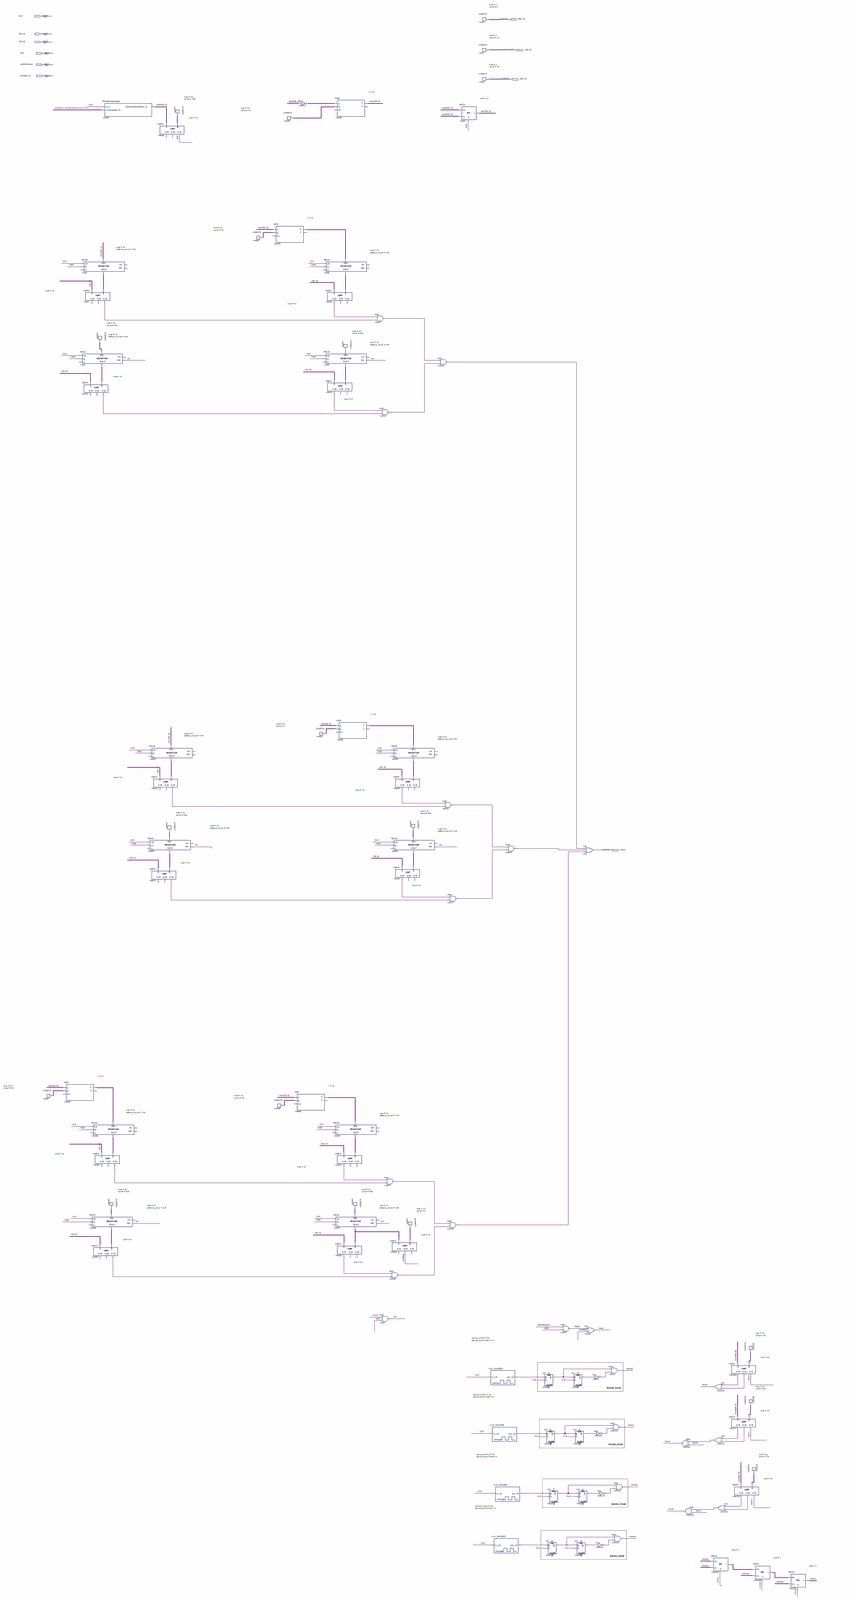
[diagram p0: schematic sheet, whole]
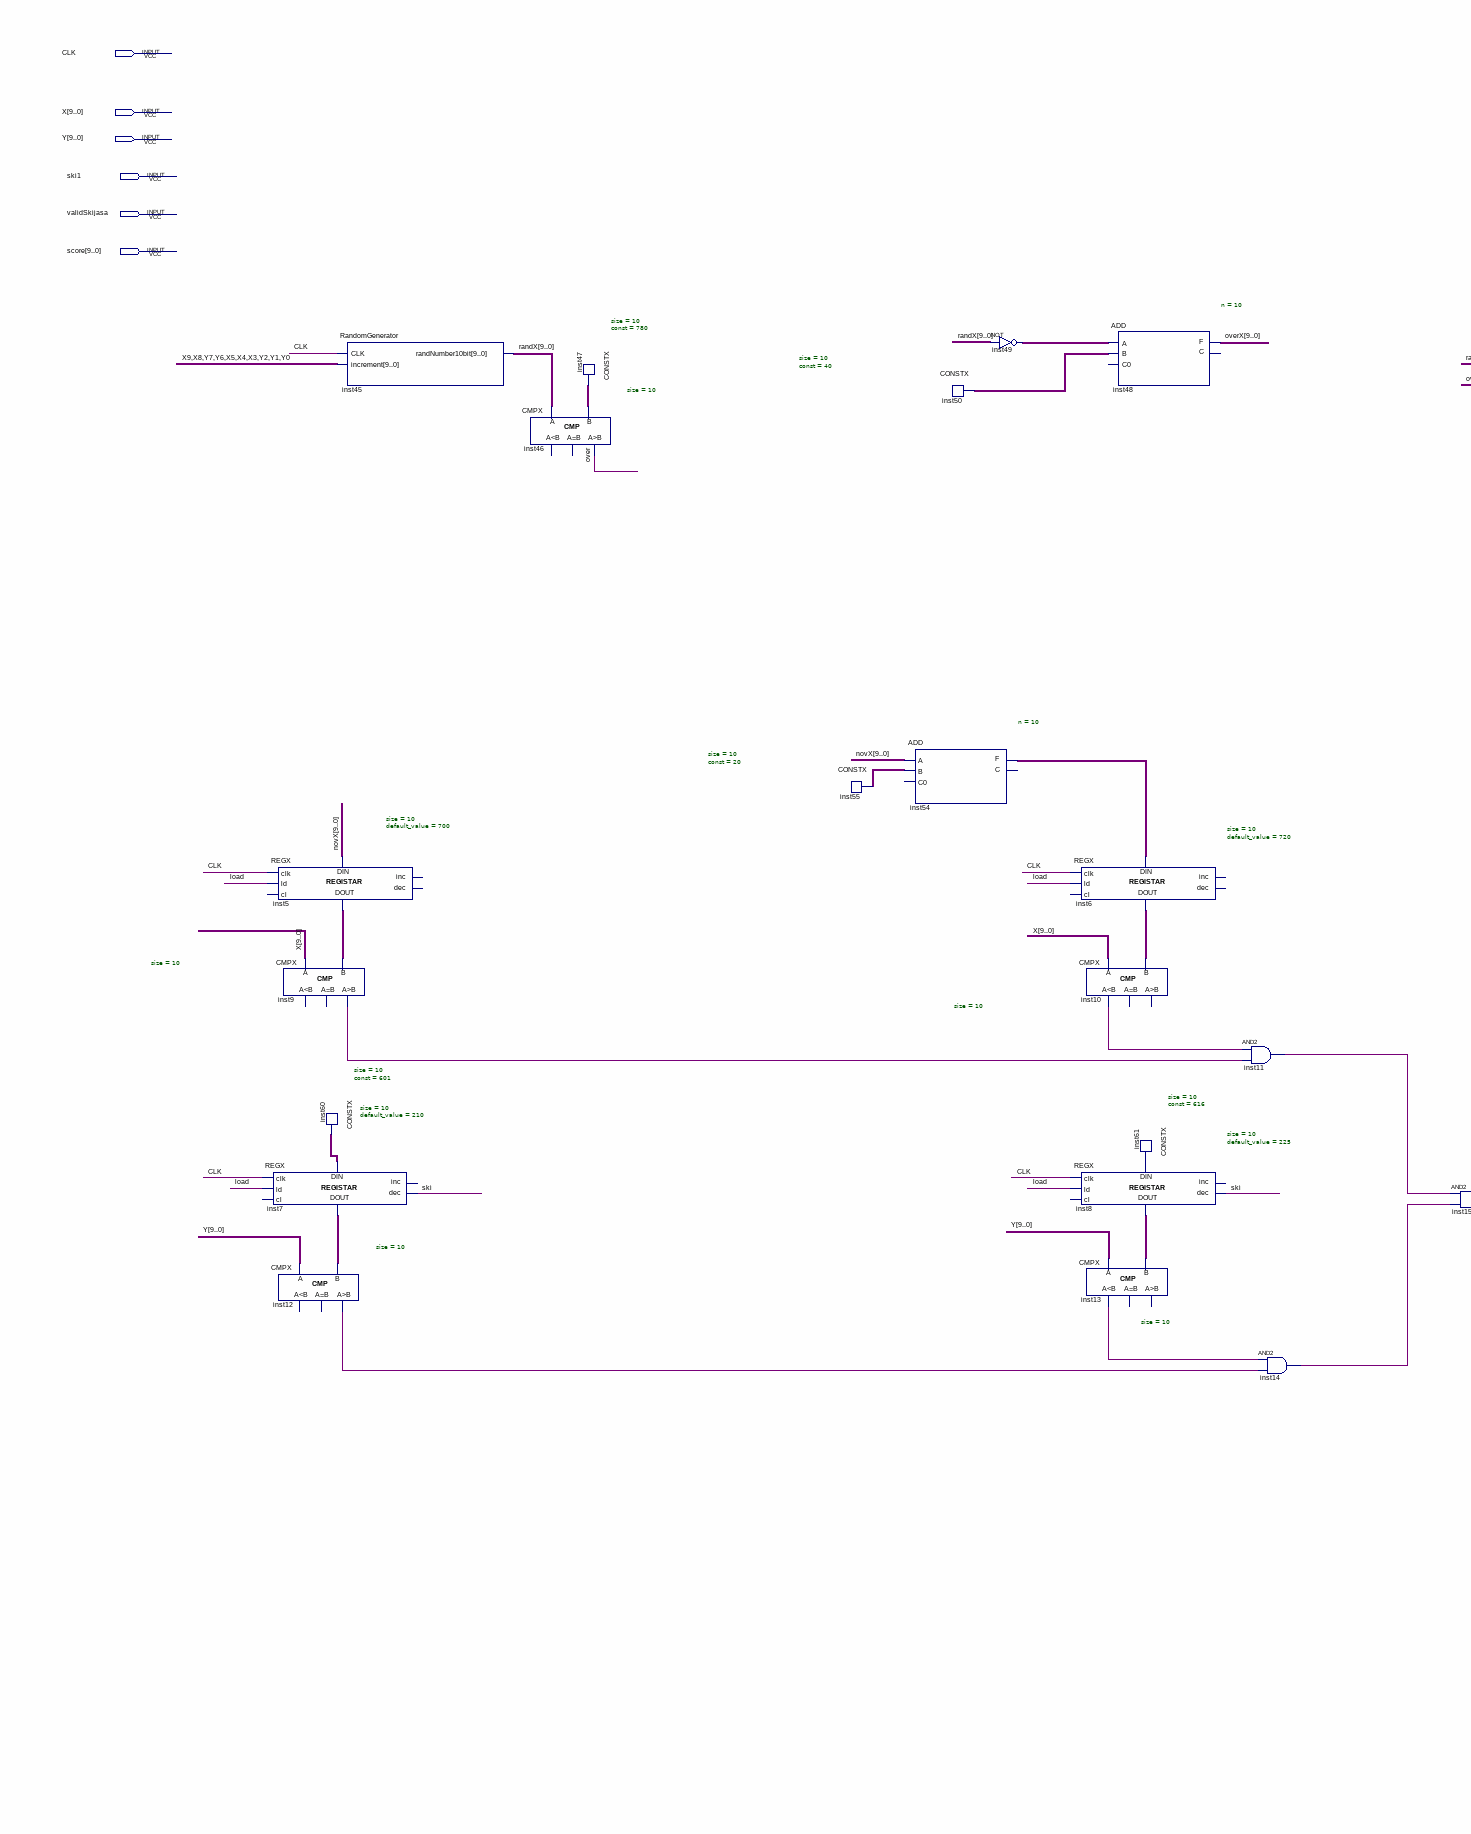
[diagram p1: schematic sheet, upper left part]
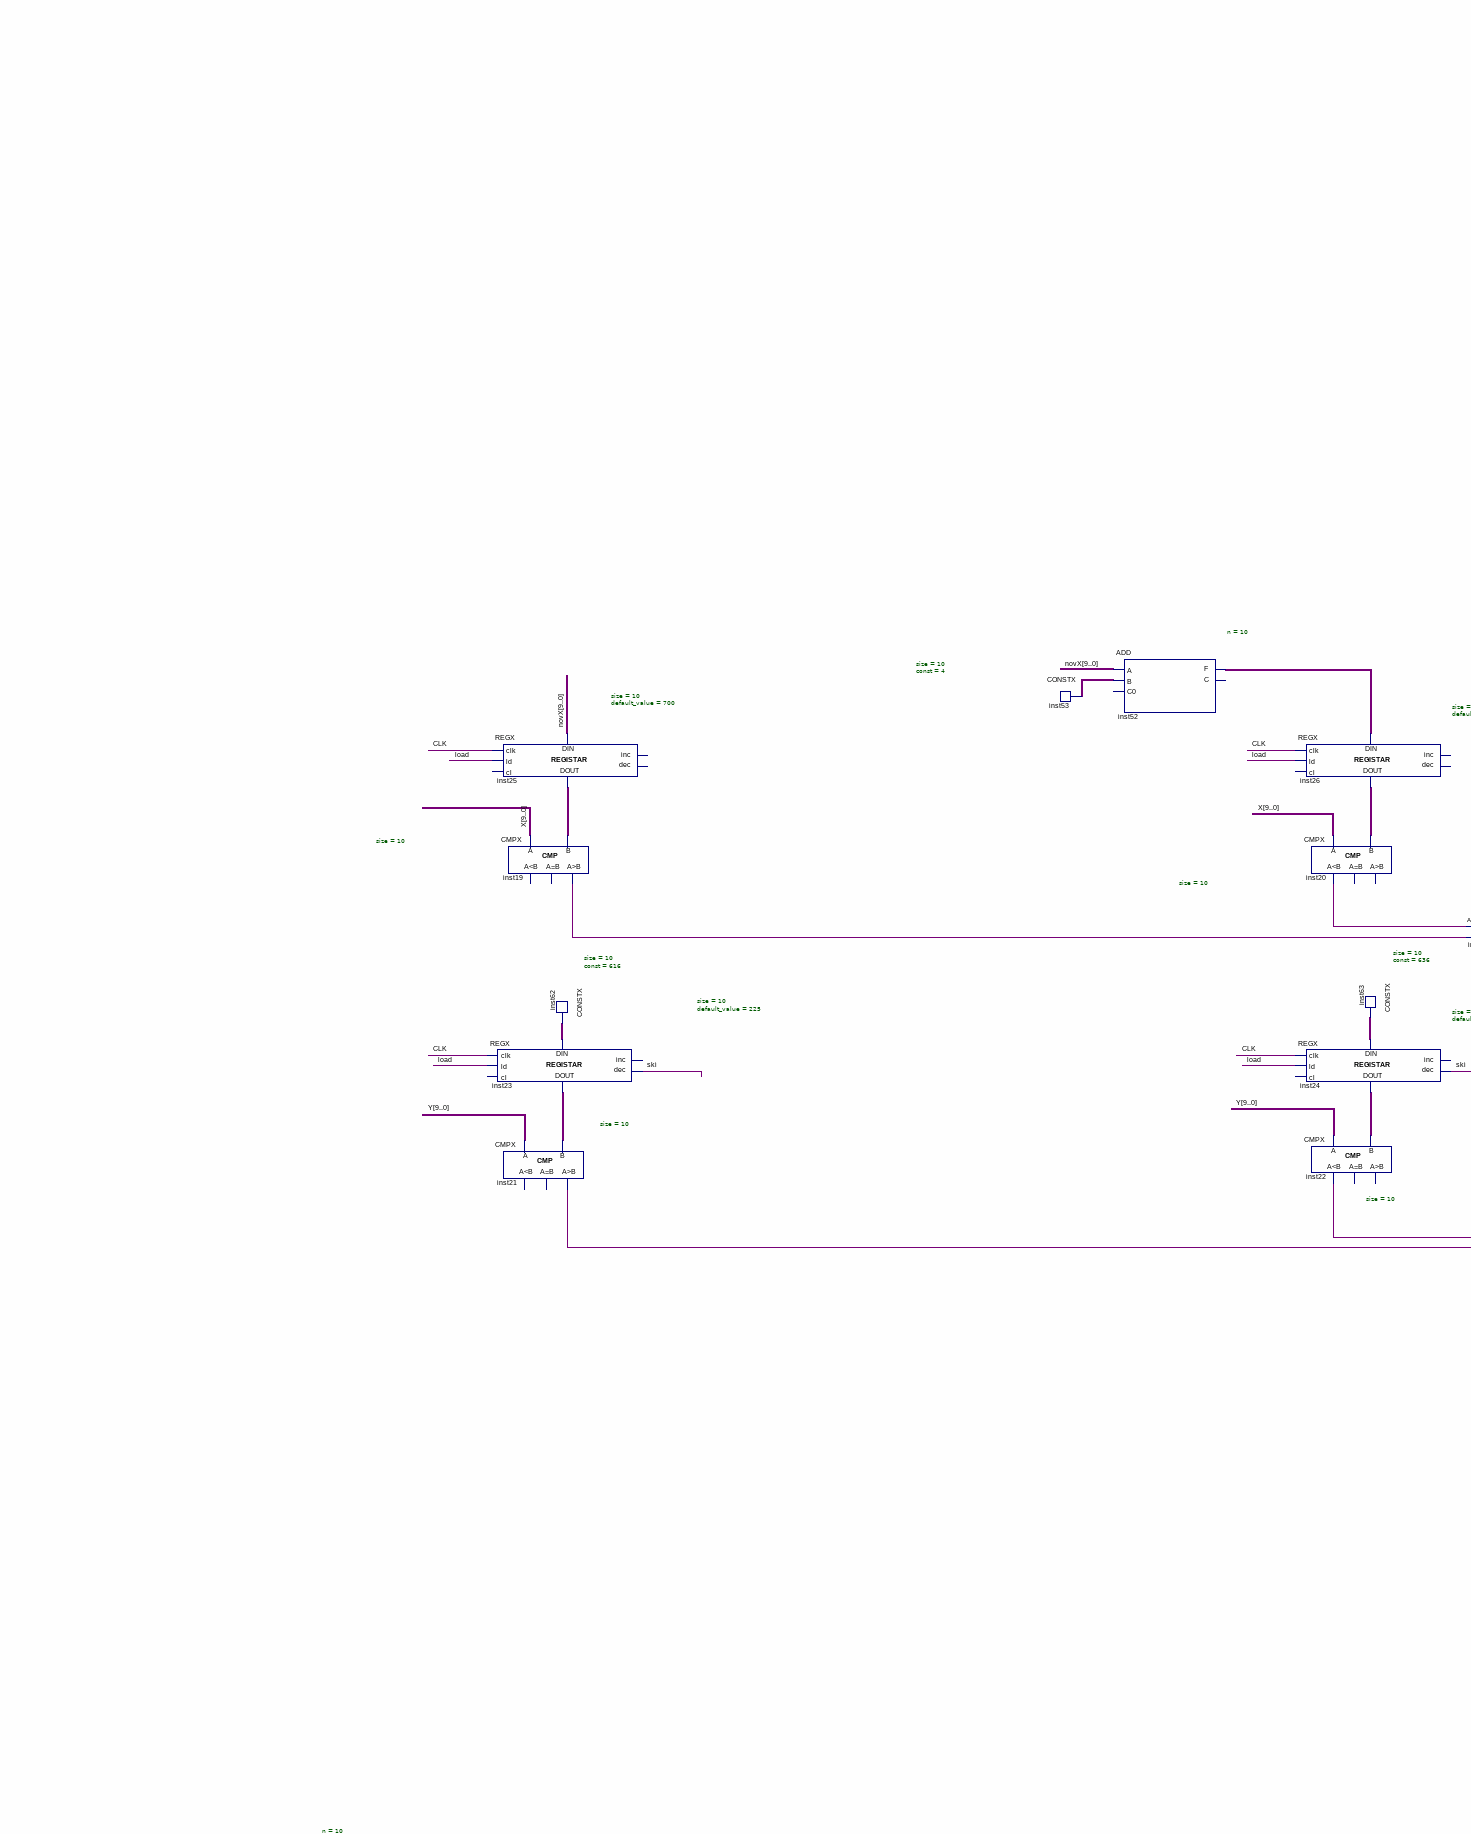
[diagram p2: schematic sheet, middle left part]
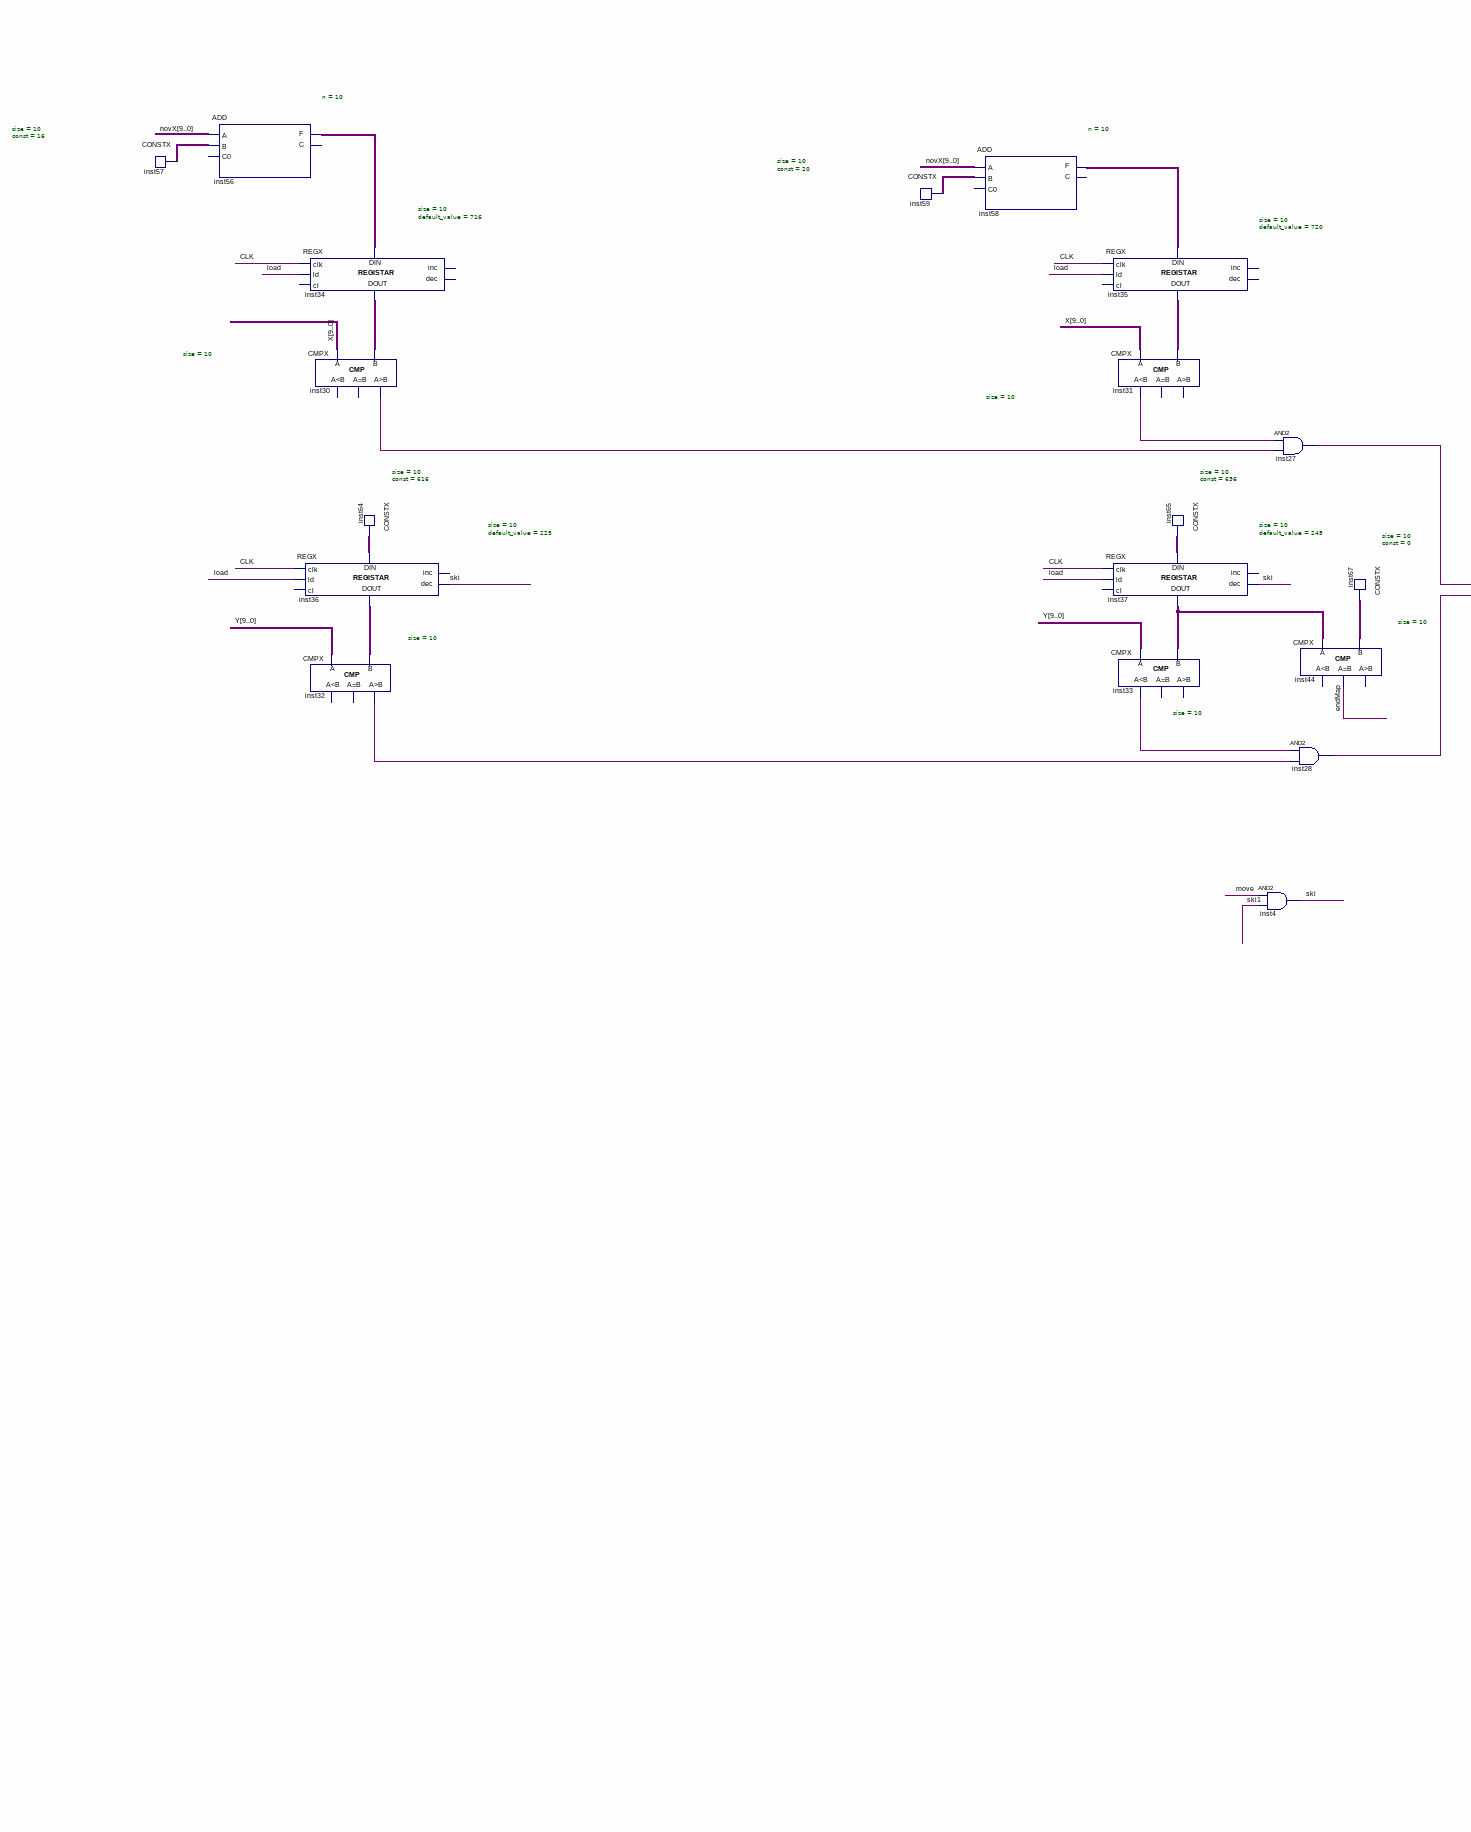
[diagram p3: schematic sheet, lower left part]
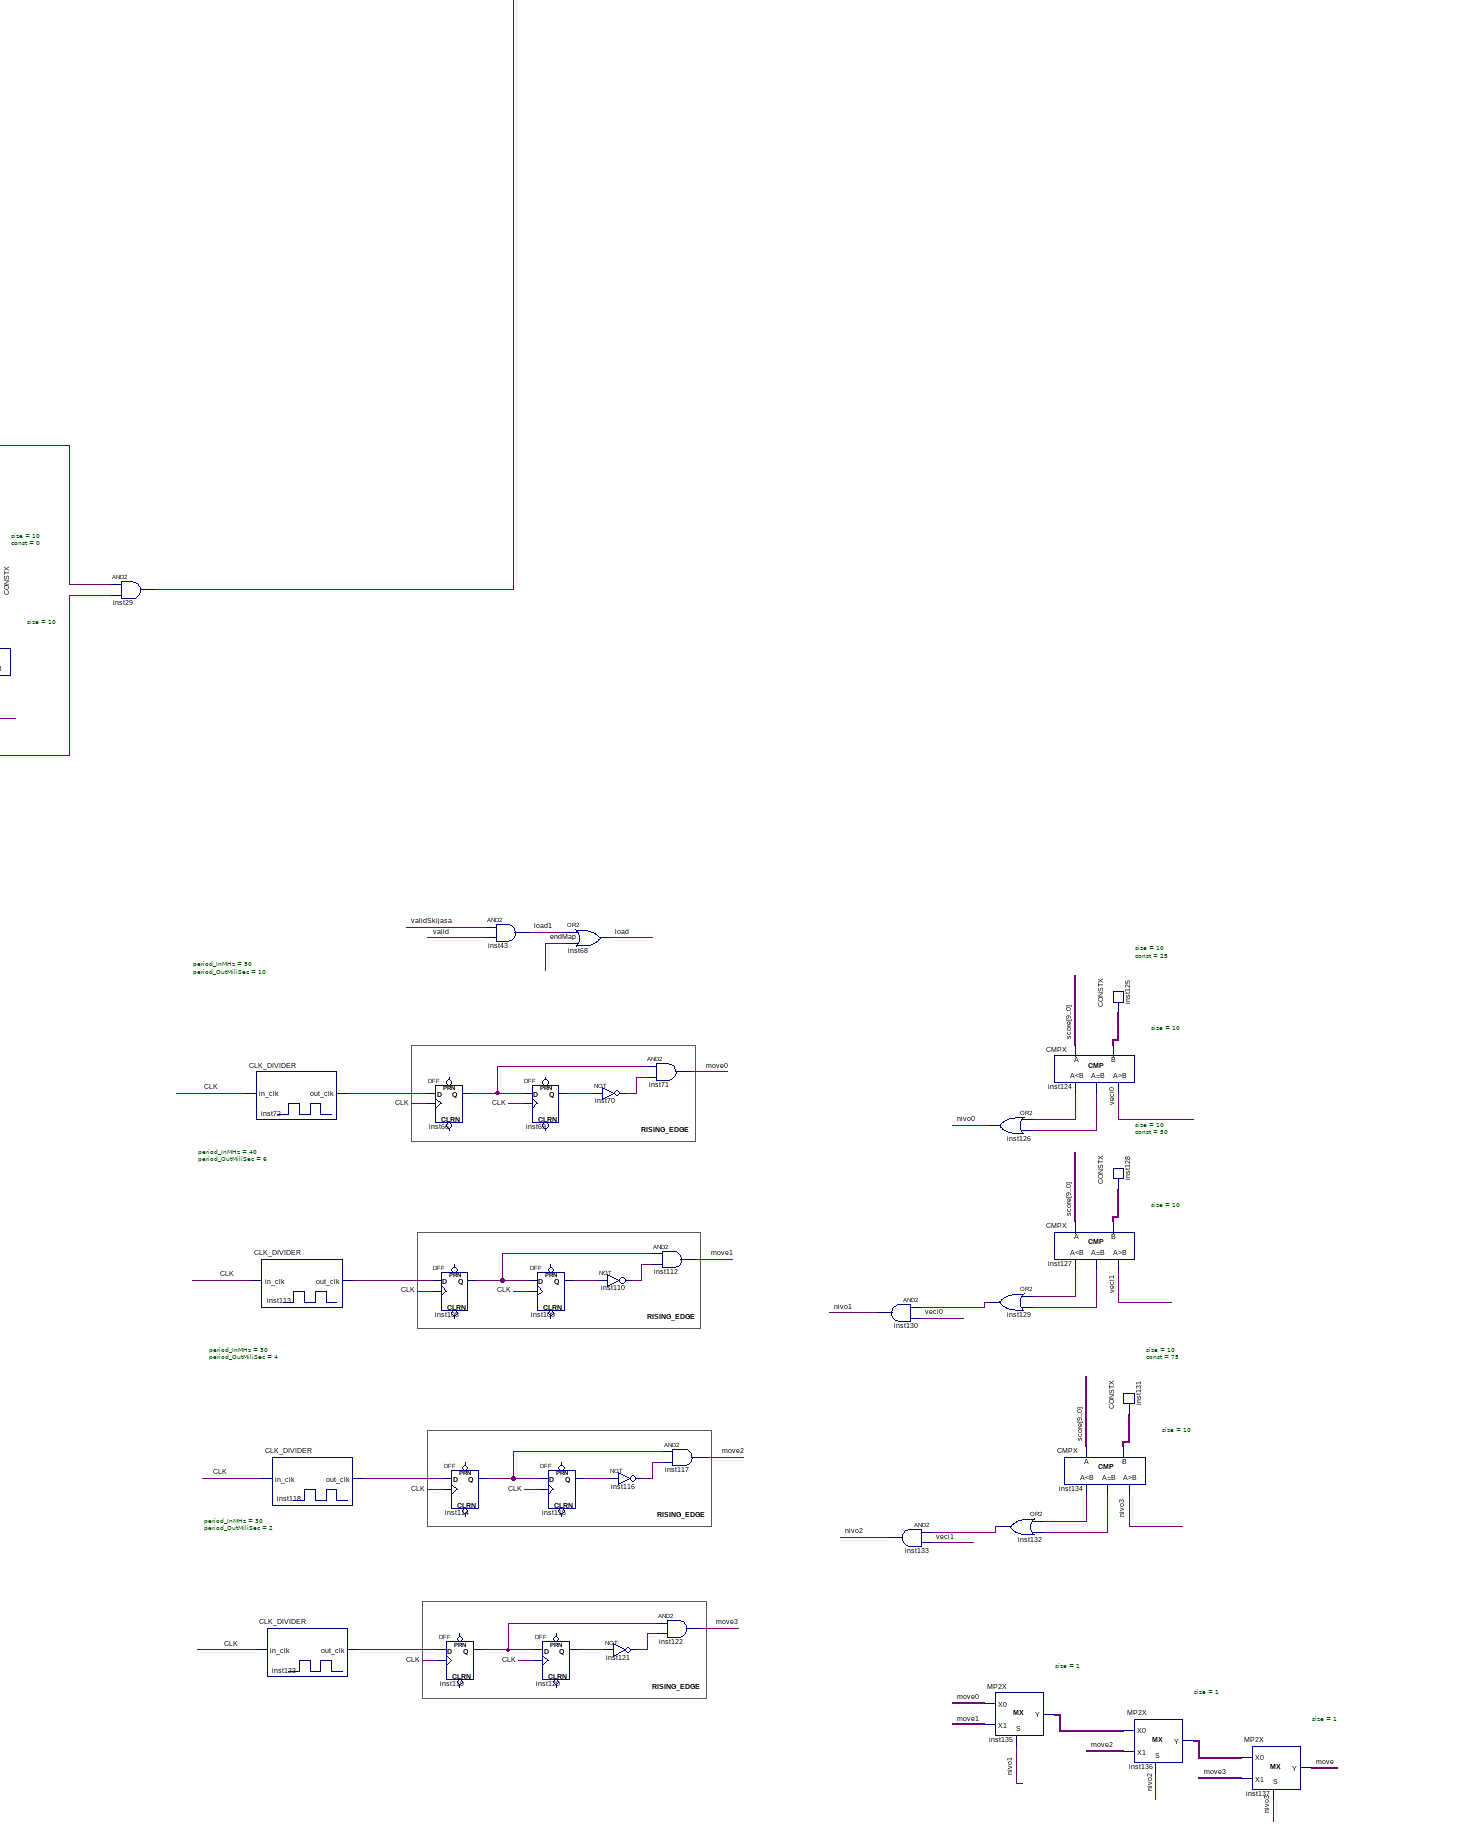
[diagram p4: schematic sheet, lower right part]
// Quartus schematic Zastavica2.bdf as structural Verilog: 97 symbols, 10 pins
module Zastavica2 (
  input  CLK,
  input  [9:0] X,
  input  [9:0] Y,
  input  ski1,
  input  validSkijasa,
  input  [9:0] score,
  output [3:0] R,
  output [3:0] G,
  output [3:0] B,
  output valid
);

  wire endMap, inst9_gr, inst10_ls, inst11_out, inst12_gr, inst13_ls, inst14_out, inst15_out, inst16_out,
       inst17_out, inst18_out, inst19_gr, inst20_ls, inst21_gr, inst22_ls, inst27_out, inst28_out,
       inst29_out, inst30_gr, inst31_ls, inst32_gr, inst33_ls, inst66_q, inst69_q, inst70_out,
       inst72_out_clk, inst108_q, inst109_q, inst110_out, inst113_out_clk, inst114_q, inst115_q, inst116_out,
       inst118_out_clk, inst119_q, inst120_q, inst121_out, inst123_out_clk, inst124_eq, inst124_ls,
       inst127_eq, inst127_ls, inst129_out, inst132_out, inst134_eq, inst134_ls, inst135_y, inst136_y, load,
       load1, move, move0, move1, move2, move3, nivo0, nivo1, nivo2, nivo3, over, ski, veci0, veci1;
  wire [9:0] inst5_data_out, inst6_data_out, inst7_data_out, inst8_data_out, inst23_data_out,
       inst24_data_out, inst25_data_out, inst26_data_out, inst34_data_out, inst35_data_out, inst36_data_out,
       inst37_data_out, inst47_data, inst49_out, inst50_data, inst52_f, inst53_data, inst54_f, inst55_data,
       inst56_f, inst57_data, inst58_f, inst59_data, inst60_data, inst61_data, inst62_data, inst63_data,
       inst64_data, inst65_data, inst67_data, inst125_data, inst128_data, inst131_data, novX, overX, randX;

  CONSTX #(.size(10), .\const (16)) inst57 (.data(inst57_data));
  ADD #(.n(10)) inst56 (.A(novX), .B(inst57_data), .F(inst56_f));  // open: C0, C
  REGX #(.size(10), .default_value(700)) inst5 (
    .clk(CLK), .ld(load), .data_in(novX), .data_out(inst5_data_out));  // open: cl, inc, dec
  CMPX #(.size(10)) inst9 (.A(X), .B(inst5_data_out), .gr(inst9_gr));  // open: ls, eq
  REGX #(.size(10), .default_value(210)) inst7 (
    .clk(CLK), .ld(load), .dec(ski), .data_in(inst60_data), .data_out(inst7_data_out));  // open: cl, inc
  CMPX #(.size(10)) inst12 (.A(Y), .B(inst7_data_out), .gr(inst12_gr));  // open: ls, eq
  REGX #(.size(10), .default_value(716)) inst34 (
    .clk(CLK), .ld(load), .data_in(inst56_f), .data_out(inst34_data_out));  // open: cl, inc, dec
  REGX #(.size(10), .default_value(225)) inst36 (
    .clk(CLK), .ld(load), .dec(ski), .data_in(inst64_data), .data_out(inst36_data_out));  // open: cl, inc
  CMPX #(.size(10)) inst32 (.A(Y), .B(inst36_data_out), .gr(inst32_gr));  // open: ls, eq
  RandomGenerator inst45 (.CLK(CLK), .increment({X[9:8], Y[7:6], X[5:3], Y[2:0]}), .randNumber10bit(randX));
  CONSTX #(.size(10), .\const (601)) inst60 (.data(inst60_data));
  CMPX #(.size(10)) inst30 (.A(X), .B(inst34_data_out), .gr(inst30_gr));  // open: ls, eq
  CONSTX #(.size(10), .\const (616)) inst64 (.data(inst64_data));
  REGX #(.size(10), .default_value(700)) inst25 (
    .clk(CLK), .ld(load), .data_in(novX), .data_out(inst25_data_out));  // open: cl, inc, dec
  CMPX #(.size(10)) inst19 (.A(X), .B(inst25_data_out), .gr(inst19_gr));  // open: ls, eq
  REGX #(.size(10), .default_value(225)) inst23 (
    .clk(CLK), .ld(load), .dec(ski), .data_in(inst62_data), .data_out(inst23_data_out));  // open: cl, inc
  CMPX #(.size(10)) inst21 (.A(Y), .B(inst23_data_out), .gr(inst21_gr));  // open: ls, eq
  CMPX #(.size(10)) inst46 (.A(randX), .B(inst47_data), .gr(over));  // open: ls, eq
  CONSTX #(.size(10), .\const (616)) inst62 (.data(inst62_data));
  CONSTX #(.size(10), .\const (780)) inst47 (.data(inst47_data));
  CONSTX #(.size(10), .\const (20)) inst55 (.data(inst55_data));
  CONSTX #(.size(10), .\const (40)) inst50 (.data(inst50_data));
  ADD #(.n(10)) inst54 (.A(novX), .B(inst55_data), .F(inst54_f));  // open: C0, C
  CONSTX #(.size(10), .\const (20)) inst59 (.data(inst59_data));
  ADD #(.n(10)) inst58 (.A(novX), .B(inst59_data), .F(inst58_f));  // open: C0, C
  assign inst49_out = ~randX;  // NOT inst49, 10 bits wide
  REGX #(.size(10), .default_value(720)) inst6 (
    .clk(CLK), .ld(load), .data_in(inst54_f), .data_out(inst6_data_out));  // open: cl, inc, dec
  REGX #(.size(10), .default_value(225)) inst8 (
    .clk(CLK), .ld(load), .dec(ski), .data_in(inst61_data), .data_out(inst8_data_out));  // open: cl, inc
  CONSTX #(.size(10), .\const (4)) inst53 (.data(inst53_data));
  ADD #(.n(10)) inst48 (.A(inst49_out), .B(inst50_data), .F(overX));  // open: C0, C
  CMPX #(.size(10)) inst10 (.A(X), .B(inst6_data_out), .ls(inst10_ls));  // open: eq, gr
  CMPX #(.size(10)) inst13 (.A(Y), .B(inst8_data_out), .ls(inst13_ls));  // open: eq, gr
  ADD #(.n(10)) inst52 (.A(novX), .B(inst53_data), .F(inst52_f));  // open: C0, C
  REGX #(.size(10), .default_value(720)) inst35 (
    .clk(CLK), .ld(load), .data_in(inst58_f), .data_out(inst35_data_out));  // open: cl, inc, dec
  CMPX #(.size(10)) inst31 (.A(X), .B(inst35_data_out), .ls(inst31_ls));  // open: eq, gr
  REGX #(.size(10), .default_value(245)) inst37 (
    .clk(CLK), .ld(load), .dec(ski), .data_in(inst65_data), .data_out(inst37_data_out));  // open: cl, inc
  CMPX #(.size(10)) inst33 (.A(Y), .B(inst37_data_out), .ls(inst33_ls));  // open: eq, gr
  CONSTX #(.size(10), .\const (616)) inst61 (.data(inst61_data));
  CONSTX #(.size(10), .\const (636)) inst65 (.data(inst65_data));
  and inst11 (inst11_out, inst10_ls, inst9_gr);
  and inst14 (inst14_out, inst13_ls, inst12_gr);
  and inst27 (inst27_out, inst31_ls, inst30_gr);
  and inst4 (ski, move, ski1);
  REGX #(.size(10), .default_value(704)) inst26 (
    .clk(CLK), .ld(load), .data_in(inst52_f), .data_out(inst26_data_out));  // open: cl, inc, dec
  CMPX #(.size(10)) inst20 (.A(X), .B(inst26_data_out), .ls(inst20_ls));  // open: eq, gr
  REGX #(.size(10), .default_value(245)) inst24 (
    .clk(CLK), .ld(load), .dec(ski), .data_in(inst63_data), .data_out(inst24_data_out));  // open: cl, inc
  CMPX #(.size(10)) inst22 (.A(Y), .B(inst24_data_out), .ls(inst22_ls));  // open: eq, gr
  CMPX #(.size(10)) inst44 (.A(inst37_data_out), .B(inst67_data), .eq(endMap));  // open: ls, gr
  and inst28 (inst28_out, inst33_ls, inst32_gr);
  CONSTX #(.size(10), .\const (636)) inst63 (.data(inst63_data));
  CONSTX #(.size(10), .\const (0)) inst67 (.data(inst67_data));
  and inst15 (inst15_out, inst11_out, inst14_out);
  and inst16 (inst16_out, inst20_ls, inst19_gr);
  and inst17 (inst17_out, inst22_ls, inst21_gr);
  and inst29 (inst29_out, inst27_out, inst28_out);
  MP2X #(.size(10)) inst51 (.S(over), .X0(randX), .X1(overX), .Y(novX));
  CONSTX #(.size(4), .\const (0)) inst3 (.data(R));
  CONSTX #(.size(4), .\const (12)) inst1 (.data(G));
  CONSTX #(.size(4), .\const (15)) inst2 (.data(B));
  CLK_DIVIDER #(.period_InMHz(50), .period_OutMiliSec(10)) inst72 (.in_clk(CLK), .out_clk(inst72_out_clk));
  CLK_DIVIDER #(.period_InMHz(40), .period_OutMiliSec(6)) inst113 (.in_clk(CLK), .out_clk(inst113_out_clk));
  CLK_DIVIDER #(.period_InMHz(30), .period_OutMiliSec(2)) inst123 (.in_clk(CLK), .out_clk(inst123_out_clk));
  CLK_DIVIDER #(.period_InMHz(30), .period_OutMiliSec(4)) inst118 (.in_clk(CLK), .out_clk(inst118_out_clk));
  and inst18 (inst18_out, inst16_out, inst17_out);
  DFF inst66 (.CLK(CLK), .D(inst72_out_clk), .Q(inst66_q));  // open: CLRN, PRN
  DFF inst108 (.CLK(CLK), .D(inst113_out_clk), .Q(inst108_q));  // open: CLRN, PRN
  DFF inst114 (.CLK(CLK), .D(inst118_out_clk), .Q(inst114_q));  // open: CLRN, PRN
  DFF inst119 (.CLK(CLK), .D(inst123_out_clk), .Q(inst119_q));  // open: CLRN, PRN
  and inst43 (load1, validSkijasa, valid);
  DFF inst69 (.CLK(CLK), .D(inst66_q), .Q(inst69_q));  // open: CLRN, PRN
  DFF inst109 (.CLK(CLK), .D(inst108_q), .Q(inst109_q));  // open: CLRN, PRN
  DFF inst115 (.CLK(CLK), .D(inst114_q), .Q(inst115_q));  // open: CLRN, PRN
  DFF inst120 (.CLK(CLK), .D(inst119_q), .Q(inst120_q));  // open: CLRN, PRN
  or inst (valid, inst15_out, inst18_out, inst29_out);
  or inst68 (load, load1, endMap);
  not inst70 (inst70_out, inst69_q);
  not inst110 (inst110_out, inst109_q);
  not inst116 (inst116_out, inst115_q);
  not inst121 (inst121_out, inst120_q);
  and inst71 (move0, inst66_q, inst70_out);
  and inst112 (move1, inst108_q, inst110_out);
  and inst117 (move2, inst114_q, inst116_out);
  and inst122 (move3, inst119_q, inst121_out);
  and inst130 (nivo1, inst129_out, veci0);
  and inst133 (nivo2, inst132_out, veci1);
  MP2X #(.size(1)) inst135 (.S(nivo1), .X0(move0), .X1(move1), .Y(inst135_y));
  or inst126 (nivo0, inst124_ls, inst124_eq);
  or inst129 (inst129_out, inst127_ls, inst127_eq);
  or inst132 (inst132_out, inst134_ls, inst134_eq);
  CMPX #(.size(10)) inst124 (.A(score), .B(inst125_data), .ls(inst124_ls), .eq(inst124_eq), .gr(veci0));
  CMPX #(.size(10)) inst127 (.A(score), .B(inst128_data), .ls(inst127_ls), .eq(inst127_eq), .gr(veci1));
  CMPX #(.size(10)) inst134 (.A(score), .B(inst131_data), .ls(inst134_ls), .eq(inst134_eq), .gr(nivo3));
  CONSTX #(.size(10), .\const (25)) inst125 (.data(inst125_data));
  CONSTX #(.size(10), .\const (50)) inst128 (.data(inst128_data));
  CONSTX #(.size(10), .\const (75)) inst131 (.data(inst131_data));
  MP2X #(.size(1)) inst136 (.S(nivo2), .X0(inst135_y), .X1(move2), .Y(inst136_y));
  MP2X #(.size(1)) inst137 (.S(nivo3), .X0(inst136_y), .X1(move3), .Y(move));

  // Notes on the sheet:
  //   RISING_EDGE
  //   RISING_EDGE
  //   RISING_EDGE
  //   RISING_EDGE
endmodule
